# Altium schematic sheet [20] SwitchingRegulator CH C-D.SchDoc: Switching regulator Channel C-D
size 393 x 281 mm; Address1: Gruvgatan 8; Address2: SE-42130 Västra Frölunda; Address3: http://www.omnisys.se; Address4: Phone: +46 31 734 3400; Revision: Rev; SheetNumber: 20; SheetTotal: 21; CompanyName: Omnisys Instruments AB; Project: Enter value; ReleaseDate: Date; PageSetup: Record=PageOptions|CenterHorizontal=True|CenterVertical=True|PrintScale=0.97|XCorrection=1.00|YCorrection=1.00|PrintKind=0|BorderSize=5000000|LeftOffset=0|BottomOffset=0|Orientation=2|PaperLength=1000|PaperWidth=1000|Scale=100|PaperSource=7|PrintQuality=-4|MediaType=1|DitherType=10|PaperKind=A3|PrintScaleMode=1; Notes: No notes; Part_And_Rev: 0000-00; Drawing_Configuration: No Configuration; Adr1: August Barks gata 6B; Adr2: SE-421 32 Västra Frölunda; Adr3: Sweden; Webpage: www.omnisys.se
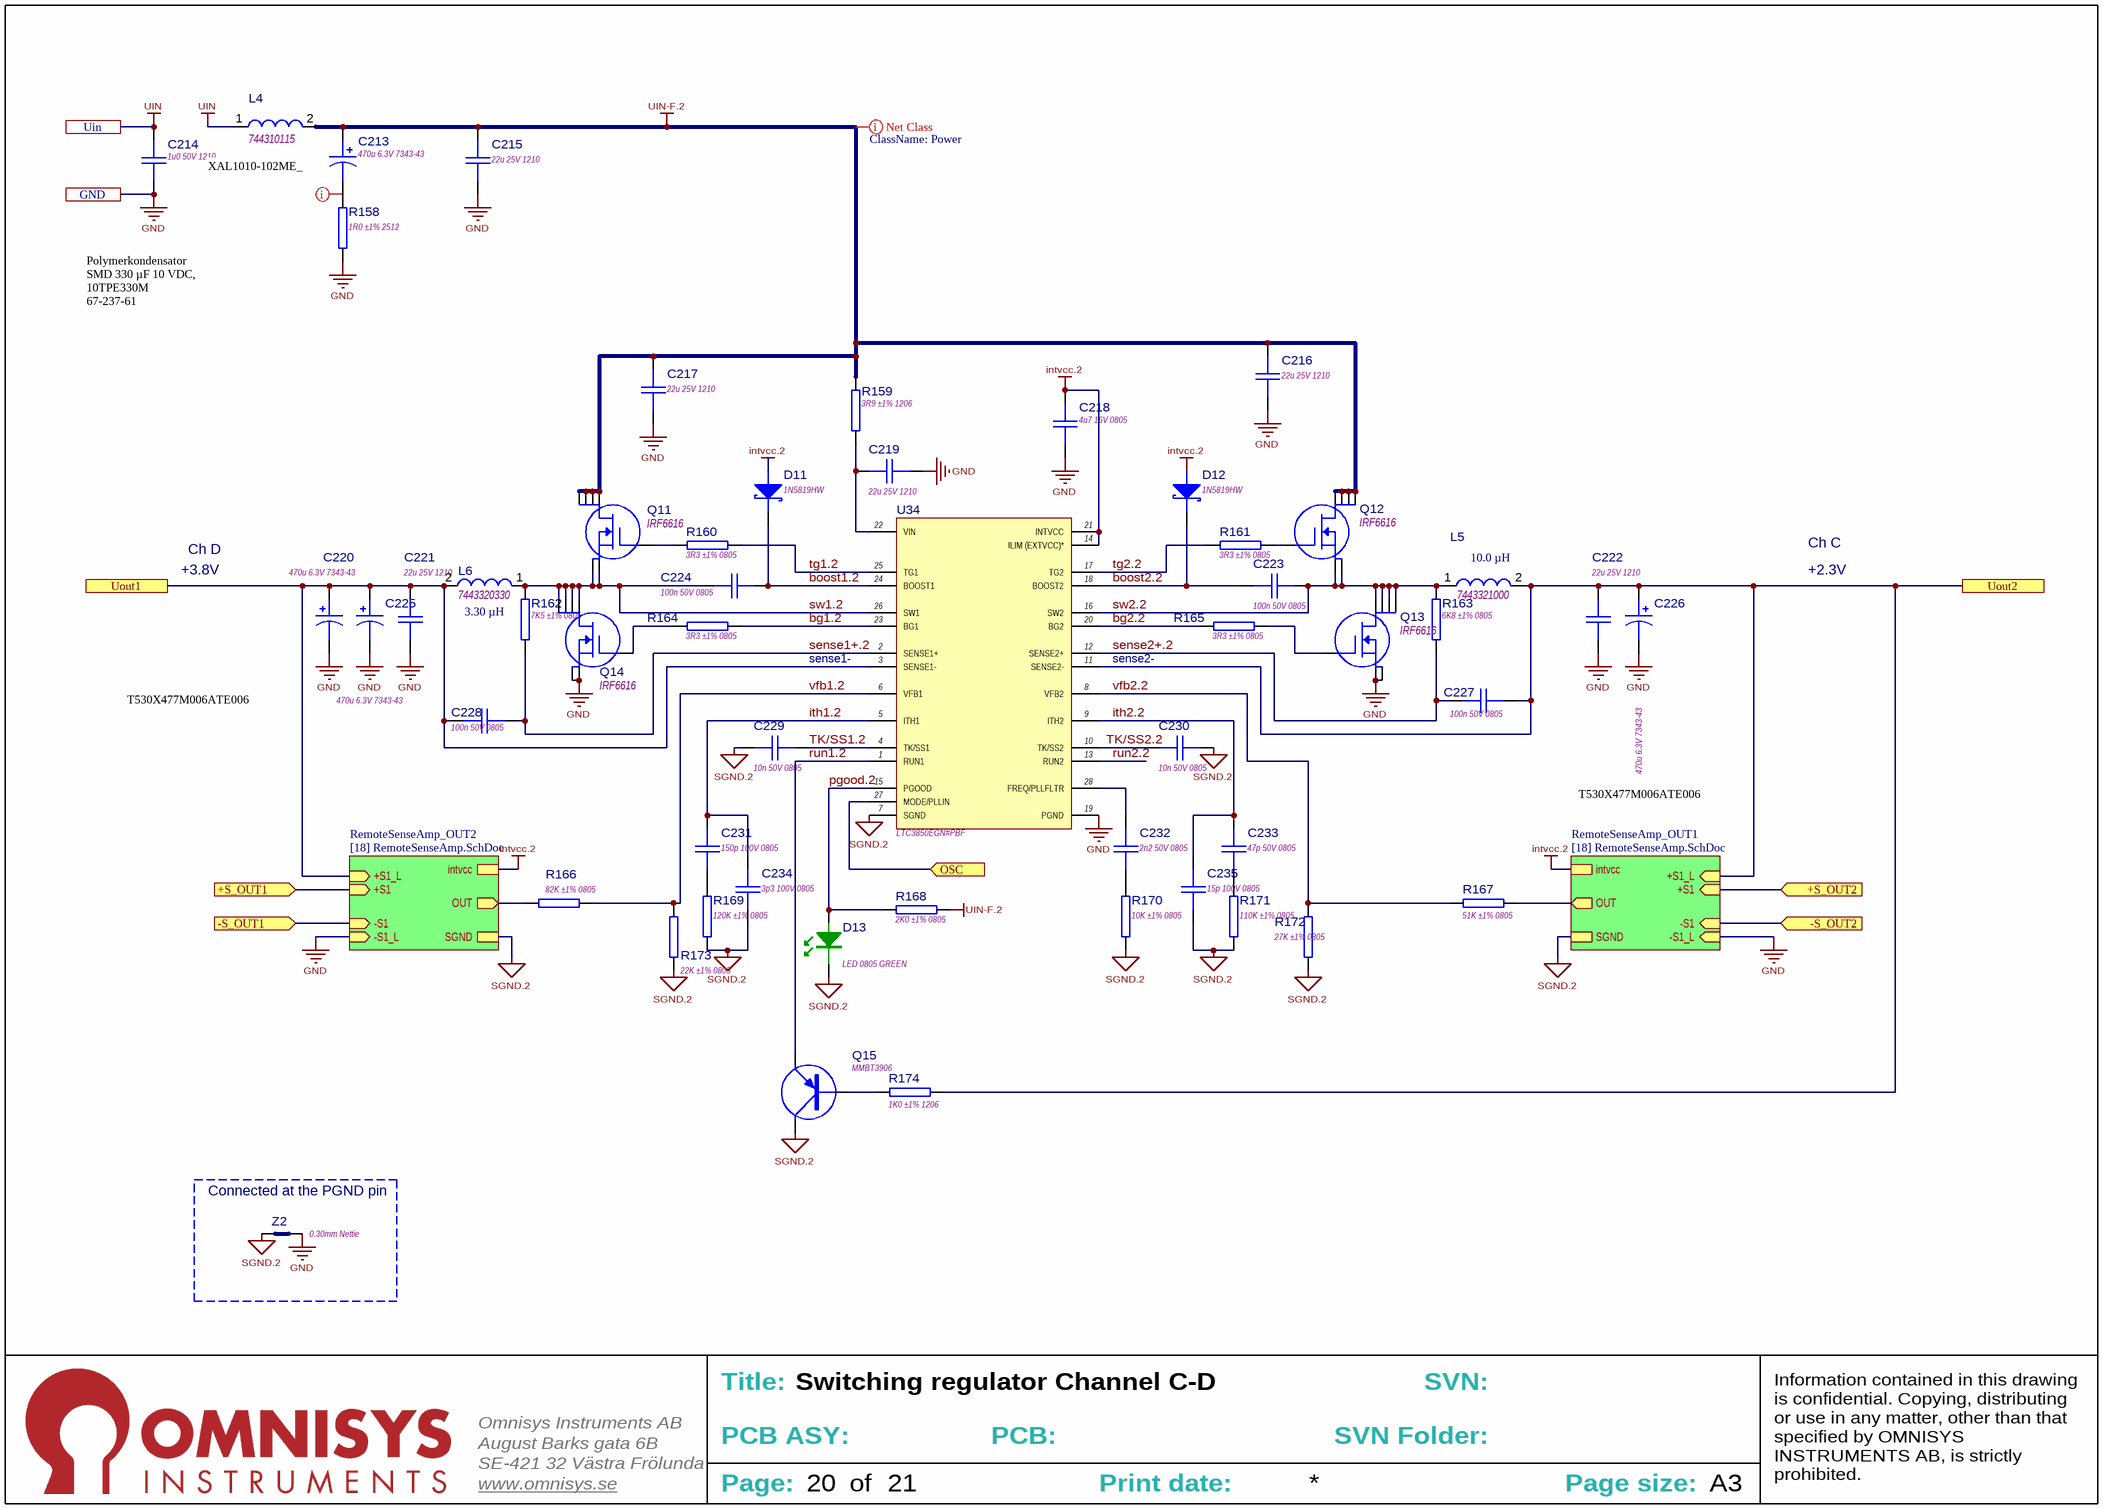
[diagram p0: [20] SwitchingRegulator CH C-D.SchDoc]

## Parts
C213  470u 6.3V 7343-43  [CAPMP7343X43N]
C214  1u0 50V 1210  [CAPC3225X200N]
C215  22u 25V 1210  [CAPC3225X270N]
C216  22u 25V 1210  [CAPC3225X270N]
C217  22u 25V 1210  [CAPC3225X270N]
C218  4u7 16V 0805  [CAPC2012X140N]
C219  22u 25V 1210  [CAPC3225X270N]
C220  470u 6.3V 7343-43  [CAPMP7343X43N]
C221  22u 25V 1210  [CAPC3225X270N]
C222  22u 25V 1210  [CAPC3225X270N]
C223  100n 50V 0805  [CAPC2012X135N]
C224  100n 50V 0805  [CAPC2012X135N]
C225  470u 6.3V 7343-43  [CAPMP7343X43N]
C226  470u 6.3V 7343-43  [CAPMP7343X43N]
C227  100n 50V 0805  [CAPC2012X135N]
C228  100n 50V 0805  [CAPC2012X135N]
C229  10n 50V 0805  [CAPC2012X95L]
C230  10n 50V 0805  [CAPC2012X95L]
C231  150p 100V 0805  [CAPC2012X70N]
C232  2n2 50V 0805  [CAPC2012X70N]
C233  47p 50V 0805  [CAPC2012X95L]
C234  3p3 100V 0805  [CAPC2012X95N]
C235  15p 100V 0805  [CAPC2012X95N]
D11  1N5819HW  [SOD3716X135L]
D12  1N5819HW  [SOD3716X135L]
D13  LED 0805 GREEN  [LED2012-GREEN]
L4  744310115  [WE-HCI-7030]
L5  7443321000  Inductance: 10.0 µH  [WE-HCC-1210]
L6  7443320330  Inductance: 3.30 µH  [WE-HCC-1210]
Q11  IRF6616  [DIRECTFET_MX]
Q12  IRF6616  [DIRECTFET_MX]
Q13  IRF6616  [DIRECTFET_MX]
Q14  IRF6616  [DIRECTFET_MX]
Q15  MMBT3906  [SOT95P230X110-3N]
R158  1R0 ±1% 2512  [RESC6332N]
R159  3R9 ±1% 1206  [RESC3216L]
R160  3R3 ±1% 0805  [RESC2012N]
R161  3R3 ±1% 0805  [RESC2012N]
R162  7K5 ±1% 0805  [RESC2012N]
R163  6K8 ±1% 0805  [RESC2012N]
R164  3R3 ±1% 0805  [RESC2012N]
R165  3R3 ±1% 0805  [RESC2012N]
R166  82K ±1% 0805  [RESC2012N]
R167  51K ±1% 0805  [RESC2012N]
R168  2K0 ±1% 0805  [RESC2012N]
R169  120K ±1% 0805  [RESC2012N]
R170  10K ±1% 0805  [RESC2012N]
R171  110K ±1% 0805  [RESC2012N]
R172  27K ±1% 0805  [RESC2012N]
R173  22K ±1% 0805  [RESC2012N]
R174  1K0 ±1% 1206  [RESC3216N]
U34  LTC3850EGN#PBF  [SOP64P600X175-28N]
Z2  0.30mm Nettie  [NETTIE_0.3MM]  (net tie, no BOM)

## Blocks framed on the sheet
Connected at the PGND pin: Z2

## Sub-sheets
RemoteSenseAmp_OUT1 = [18] RemoteSenseAmp.SchDoc: +S1 (in), -S1 (in), +S1_L (in), -S1_L (in), SGND, intvcc, OUT (out)
RemoteSenseAmp_OUT2 = [18] RemoteSenseAmp.SchDoc: +S1 (in), -S1 (in), +S1_L (in), -S1_L (in), SGND, intvcc, OUT (out)

## Ports
+S_OUT1 (in), +S_OUT2 (in), -S_OUT1 (in), -S_OUT2 (in), GND, OSC (in), Uin, Uout1, Uout2

## Nets
GND: C214.1 C215.2 C216.2 C217.2 C218.1 C219.2 C220.2 C221.2 C222.2 C225.2 C226.2 Q13.S1 Q13.S2 Q14.S1 Q14.S2 R158.1 U34.19(PGND) Z2.2 ; port GND, sheet RemoteSenseAmp_OUT1/-S1_L, sheet RemoteSenseAmp_OUT2/-S1_L
intvcc.2: C218.2 D11.2(A) D12.2(A) U34.14(ILIM_(EXTVCC)*) U34.21(INTVCC) ; sheet RemoteSenseAmp_OUT1/intvcc, sheet RemoteSenseAmp_OUT2/intvcc
SGND.2: C229.2 C230.2 C234.2 C235.2 D13.1 Q15.3(c) R169.2 R170.2 R171.2 R172.1 R173.1 U34.7(SGND) Z2.1 ; sheet RemoteSenseAmp_OUT1/SGND, sheet RemoteSenseAmp_OUT2/SGND
UIN: C214.2 L4.1 ; port Uin
UIN-F.2: C213.1 C215.1 C216.1 C217.1 L4.2 Q11.D1 Q11.D2 Q11.D3 Q11.D4 Q12.D1 Q12.D2 Q12.D3 Q12.D4 R159.2 R168.2
+S_OUT1: port +S_OUT1, sheet RemoteSenseAmp_OUT2/+S1
+S_OUT2: port +S_OUT2, sheet RemoteSenseAmp_OUT1/+S1
-S_OUT1: port -S_OUT1, sheet RemoteSenseAmp_OUT2/-S1
-S_OUT2: port -S_OUT2, sheet RemoteSenseAmp_OUT1/-S1
bg1.2: R164.2 U34.23(BG1)
bg2.2: R165.1 U34.20(BG2)
boost1.2: C224.2 D11.1(K) U34.24(BOOST1)
boost2.2: C223.2 D12.1(K) U34.18(BOOST2)
ith1.2: C231.1 C234.1 U34.5(ITH1)
ith2.2: C233.1 C235.1 U34.9(ITH2)
OSC: U34.27(MODE/PLLIN) ; port OSC
pgood.2: D13.2 R168.1 U34.15(PGOOD)
run1.2: Q15.2(e) U34.1(RUN1)
run2.2: U34.13(RUN2)
sense1+.2: C228.1 R162.2 U34.2(SENSE1+)
sense2+.2: C227.2 R163.1 U34.12(SENSE2+)
sw1.2: C224.1 L6.1 Q11.S1 Q11.S2 Q14.D1 Q14.D2 Q14.D3 Q14.D4 R162.1 U34.26(SW1)
sw2.2: C223.1 L5.1 Q12.S1 Q12.S2 Q13.D1 Q13.D2 Q13.D3 Q13.D4 R163.2 U34.16(SW2)
tg1.2: R160.2 U34.25(TG1)
tg2.2: R161.1 U34.17(TG2)
TK/SS1.2: C229.1 U34.4(TK/SS1)
TK/SS2.2: C230.1 U34.10(TK/SS2)
Uout1: C220.1 C221.1 C225.1 C228.2 L6.2 U34.3(SENSE1-) ; port Uout1, sheet RemoteSenseAmp_OUT2/+S1_L
Uout2: C222.1 C226.1 C227.1 L5.2 R174.1 U34.11(SENSE2-) ; port Uout2, sheet RemoteSenseAmp_OUT1/+S1_L
vfb1.2: R166.1 R173.2 U34.6(VFB1)
vfb2.2: R167.1 R172.2 U34.8(VFB2)
NetC213_2: C213.2 R158.2
NetC219_1: C219.1 R159.1 U34.22(VIN)
NetC231_2: C231.2 R169.1
NetC232_1: C232.1 U34.28(FREQ/PLLFLTR)
NetC232_2: C232.2 R170.1
NetC233_2: C233.2 R171.1
NetQ11_G: Q11.G R160.1
NetQ12_G: Q12.G R161.2
NetQ13_G: Q13.G R165.2
NetQ14_G: Q14.G R164.1
NetQ15_1: Q15.1(b) R174.2
NetR166_2: R166.2 ; sheet RemoteSenseAmp_OUT2/OUT
NetR167_2: R167.2 ; sheet RemoteSenseAmp_OUT1/OUT

## Layout directives
net class Power: UIN-F.2
net class POWER: NetC213_2

## Notes on the sheet
- XAL1010-102ME_
- Polymerkondensator SMD 330 µF 10 VDC, 10TPE330M
- 67-237-61
- +3.8V
- Ch D
- +2.3V
- Ch C
- T530X477M006ATE006
- (near U34) sense1-
- sense2-
- Title:
- SVN:
- August Barks gata 6B
- SE-421 32 Västra Frölunda
- Omnisys Instruments AB
- PCB ASY:
- PCB:
- SVN Folder:
- www.omnisys.se
- Page:
- of
- Print date:
- Page size:
- A3
- Information contained in this drawing is confidential. Copying, distributing or use in any matter, other than that specified by OMNISYS INSTRUMENTS AB, is strictly prohibited.

## Library data of the parts
C213 = CMP-0300-000211-4: Standard tantalum capacitor, 470u 6.3V 7343-43, Case E, TAJE477M006#NJ; DF: 10; DCL: 28; ESR: 0.4; Rated volage: 6.3; Tolerance: ±20%; Value: 470; Package: 7343-43
C214 = CMP-0300-002152-2: 1u0 50V X7R ±10% 1210 (3225 metric); PartNumber: GRM32RR71H105KA01; Capacitance: 1µF; Tolerance: 10%; Package: 3225/1210; Rated Voltgae: 50V; Temperature Charateristics: X7R; Thickness: 2mm
C215-C217 C219 C221 C222 = CMP-0300-000360-1: 22u 25V X7R ±10% 1210 (3225 metric); partnumber: GRM32ER71E226ME15; Capacitance: 22µF; LatestRevision: 1; ReleaseDateNum: 42433.5235168866; Tolerance: 10%; Cat: 25V; CreatedAt: 04/03/2016 12:33:50 PM; FootprintDescription1: Chip Capacitor, 2-Leads, Body 3,2x2,5mm, IPC Medium Density; FootprintDescription2: Chip Capacitor, 2-Leads, Body 3,2x2,5mm, IPC Low Density; FootprintDescription3: Chip Capacitor, 2-Leads, Body 3,2x2,5mm, IPC High Density; FootprintName1: CAPC3225X270N; FootprintName2: CAPC3225X270M; FootprintName3: CAPC3225X270L; FootprintRevisionID1: PCC-00143-1; FootprintRevisionID2: PCC-00142-1; FootprintRevisionID3: PCC-00141-1; Package: 3225/1210; Rated Voltage: 25V; Rated Voltgae: 25V; Temperature Charateristics: X7R; Thickness: 2.7mm
C218 = CMP-0300-003397-3: 4u7 16V X7R ±10% 0805 (2012 metric); PartNumber: GRM21BR71C475KA73; Capacitance: 4.7µF; Tolerance: 10%; Package: 2012/0805; Rated Voltage: 16V; Temperature Charateristics: X7R; Thickness: 1.4mm
C220 = CMP-0300-000211-4: Standard tantalum capacitor, 470u 6.3V 7343-43, Case E, TAJE477M006#NJ; Tolerance: ±20%; ESR: 0.4; Rated volage: 6.3; DCL: 28; DF: 10; Value: 470; Package: 7343-43
C223 C224 C227 C228 = CMP-0300-002346-3: 100n 50V X7R ±10% 0805 (2012 metric); PartNumber: GRM21BR71H104KA01; Capacitance: 100nF; Tolerance: 10%; Package: 2012/0805; Rated Voltage: 50V; Temperature Charateristics: X7R; Thickness: 1.35mm
C225 C226 = CMP-0300-000211-4: Standard tantalum capacitor, 470u 6.3V 7343-43, Case E, TAJE477M006#NJ; ESR: 0.4; Rated volage: 6.3; Tolerance: ±20%; DCL: 28; DF: 10; Value: 470; Package: 7343-43
C229 C230 = CMP-0300-002333-3: 10n 50V X7R ±10% 0805 (2012 metric); PartNumber: GRM219R71H103KA01; Capacitance: 10nF; Tolerance: 10%; Package: 2012/0805; Rated Voltage: 50V; Temperature Charateristics: X7R; Thickness: 950µm
C231 = CMP-0300-003552-3: 150p 100V C0G ±5% 0805 (2012 metric); PartNumber: GRM2165C2A151JA01; Capacitance: 150pF; Tolerance: 5%; Package: 2012/0805; Rated Voltage: 100V; Temperature Charateristics: C0G; Thickness: 700µm
C232 = CMP-0300-002270-2: 2n2 50V C0G ±5% 0805 (2012 metric); PartNumber: GRM2165C1H222JA01; Capacitance: 2.2nF; Tolerance: 5%; Package: 2012/0805; Rated Voltage: 50V; Temperature Charateristics: C0G; Thickness: 700µm
C233 = CMP-0300-001491-2: 47p 50V 0805 C0G +/-5% 0805 (2012 metric); PartNumber: GQM2195C1H470JB01; Tolerance: 5%; Capacitance: 47pF; Package: 2012/0805; Rated Voltage: 50V; Temperature Charateristics: C0G; Thickness: 950µm
C234 = CMP-0300-001007-2: 3p3 100V 0805 C0G +/-0.25pF 0805 (2012 metric); PartNumber: GQM2195C2A3R3CB01; Tolerance: 5%; Capacitance: 3.3pF; Package: 2012/0805; Rated Voltage: 100V; Temperature Charateristics: C0G; Thickness: 950µm
C235 = CMP-0300-001139-2: 15p 100V 0805 C0G +/-5% 0805 (2012 metric); PartNumber: GQM2195C2A150JB01; Tolerance: 5%; Capacitance: 15pF; Package: 2012/0805; Rated Voltage: 100V; Temperature Charateristics: C0G; Thickness: 950µm
D11 D12 = CMP-0400-000013-1: 1.0A SURFACE MOUNT SCHOTTKY BARRIER RECTIFIER; If: 1A; Vr: 40V; Vfmax: 0.45V; Case: SOD-123; Diode type: Schottky; Package: SOD-123; PartNumber: 1N5819HW
D13 = CMP-1500-000004-2
L4 = CMP-0226-00012-1: SMD Flat Wire High Current Inductor WE-HCI, L=1.15 µH; Inductance: 1.15 µH; ComponentLink1Description: Manufacturer Link; ComponentLink1URL: http://www.we-online.com; ComponentLink2Description: Datasheet; ComponentLink2URL: http://www.we-online.de/katalog/media/pdf/744310115.pdf; PackageDescription: SMD Inductor, 2-Leads, Body 7.0 x 6.9 mm; DatasheetVersion: ver 4, Jan-2008; PackageReference: WE-HCI-7030; PackageVersion: 2008
L5 = CMP-0226-00127-1: SMD High Current Cube Inductor WE-HCC, L=10.0 µH; ComponentLink1Description: Manufacturer Link; ComponentLink1URL: http://www.we-online.com; ComponentLink2Description: Datasheet; ComponentLink2URL: http://www.we-online.de/katalog/media/pdf/7443321000.pdf; DatasheetVersion: ver 2, Nov-2009; PackageReference: WE-HCC-1210; PackageVersion: 2009; PackageDescription: Inductor, 2-Leads, Body 12.1 x 11.4 mm
L6 = CMP-0226-00120-1: SMD High Current Cube Inductor WE-HCC, L=3.30 µH; ComponentLink1Description: Manufacturer Link; ComponentLink1URL: http://www.we-online.com; ComponentLink2Description: Datasheet; ComponentLink2URL: http://www.we-online.de/katalog/media/pdf/7443320330.pdf; PackageVersion: 2009; DatasheetVersion: ver 2, Nov-2009; PackageDescription: Inductor, 2-Leads, Body 12.1 x 11.4 mm; PackageReference: WE-HCC-1210
Q11-Q14 = CMP-1700-000001-1: N-Channel MOSFET 40V, 19A, 3.7 mOhm, DirectFET; Vgsth: 1.8V; Id: 19A; Rdson: 3.7 mOhm; Vds: 40V; partnumber: IRF6616
Q15 = CMP-1700-000017-2: PNP Bipolar transistor, 40V/0.2A, SOT-23; Vce: -40V; Hfe: 100; Ic: -0.2A
R158 = CMP-1800-002826-1: 1R0 ±1% ±100 ppm/˚C 1W 500V 2512 (6332 metric); Value: 1.00; Power: 0.10W; Case-EIA: 2512; Case-Metric: 6332; Temp. Coefficent: ±100 ppm/°C; Tolerance: ±1%; Maximum working voltage: 500V; Technology: SMT
R159 = CMP-1800-002664-2: 3R9 ±1% ±100 ppm/˚C 0.25W 200V 1206 (3216 metric); Tolerance: 1; Value: 3.90; Power: 0.250W; Case-EIA: 1206; Case-Metric: 3216; Temp. Coefficent: ±100; Maximum working voltage: 200V; Technology: SMT
R160 R161 R164 R165 = CMP-1800-000013-3: 3R3 ±1% ±200 ppm/˚C 0.125W 150V 0805 (2012 metric); Value: 3.3; Temp. Coefficent: 0.02%; Power: 125mW; Case-EIA: 0805; Case-Metric: 2012; Tolerance: 1%; Maximum working voltage: 150V; Technology: SMT
R162 = CMP-1800-000094-3: 7K5 ±1% ±100 ppm/˚C 0.125W 150V 0805 (2012 metric); Value: 7.5k; Power: 125mW; Case-EIA: 0805; Case-Metric: 2012; Temp. Coefficent: 0.01%; Tolerance: 1%; Maximum working voltage: 150V; Technology: SMT
R163 = CMP-1800-000093-3: 6K8 ±1% ±100 ppm/˚C 0.125W 150V 0805 (2012 metric); Value: 6.8k; Power: 125mW; Case-EIA: 0805; Case-Metric: 2012; Temp. Coefficent: 0.01%; Tolerance: 1%; Maximum working voltage: 150V; Technology: SMT
R166 = CMP-1800-000119-3: 82K ±1% ±100 ppm/˚C 0.125W 150V 0805 (2012 metric); Power: 125mW; Case-EIA: 0805; Case-Metric: 2012; Temp. Coefficent: 0.01%; Tolerance: 1%; Value: 82k; Maximum working voltage: 150V; Technology: SMT
R167 = CMP-1800-000114-3: 51K ±1% ±100 ppm/˚C 0.125W 150V 0805 (2012 metric); Power: 125mW; Case-EIA: 0805; Case-Metric: 2012; Temp. Coefficent: 0.01%; Tolerance: 1%; Value: 51k; Maximum working voltage: 150V; Technology: SMT
R168 = CMP-1800-000080-3: 2K0 ±1% ±100 ppm/˚C 0.125W 150V 0805 (2012 metric); Value: 2k; Power: 125mW; Case-EIA: 0805; Case-Metric: 2012; Temp. Coefficent: 0.01%; Maximum working voltage: 150V; Tolerance: 1%; Technology: SMT
R169 = CMP-1800-000123-3: 120K ±1% ±100 ppm/˚C 0.125W 150V 0805 (2012 metric); Power: 125mW; Case-EIA: 0805; Case-Metric: 2012; Temp. Coefficent: 0.01%; Tolerance: 1%; Value: 120k; Maximum working voltage: 150V; Technology: SMT
R170 = CMP-1800-000097-3: 10K ±1% ±100 ppm/˚C 0.125W 150V 0805 (2012 metric); Power: 125mW; Case-EIA: 0805; Case-Metric: 2012; Temp. Coefficent: 0.01%; Tolerance: 1%; Value: 10k; Maximum working voltage: 150V; Technology: SMT
R171 = CMP-1800-000654-2: 110K ±1% ±100 ppm/˚C 0.125W 150V 0805 (2012 metric) Thickfilm; Tolerance: 1; Case-EIA: 0805; Case-Metric: 2012; Temp. Coefficent: ±100; Power: 0.125W; Maximum working voltage: 150V; Technology: SMT
R172 = CMP-1800-000107-3: 27K ±1% ±100 ppm/˚C 0.125W 150V 0805 (2012 metric); Power: 125mW; Case-EIA: 0805; Case-Metric: 2012; Temp. Coefficent: 0.01%; Tolerance: 1%; Value: 27k; Maximum working voltage: 150V; Technology: SMT
R173 = CMP-1800-000105-3: 22K ±1% ±100 ppm/˚C 0.125W 150V 0805 (2012 metric); Power: 125mW; Case-EIA: 0805; Case-Metric: 2012; Temp. Coefficent: 0.01%; Tolerance: 1%; Value: 22k; Maximum working voltage: 150V; Technology: SMT
R174 = CMP-1800-002722-2: 1K0 ±1% ±100 ppm/˚C 0.25W 200V 1206 (3216 metric); Tolerance: 1; Value: 1000.00; Power: 0.250W; Case-EIA: 1206; Case-Metric: 3216; Temp. Coefficent: ±100; Maximum working voltage: 200V; Technology: SMT
U34 = CMP-2100-000160-1: Dual, 2-Phase Synchronous Step-Down Switching Controller, LTC3850EGN#PBF; partnumber: LTC3850EGN#PBF
Z2 = CMP-1600-000019-1: Copper object for merging nets on PCB